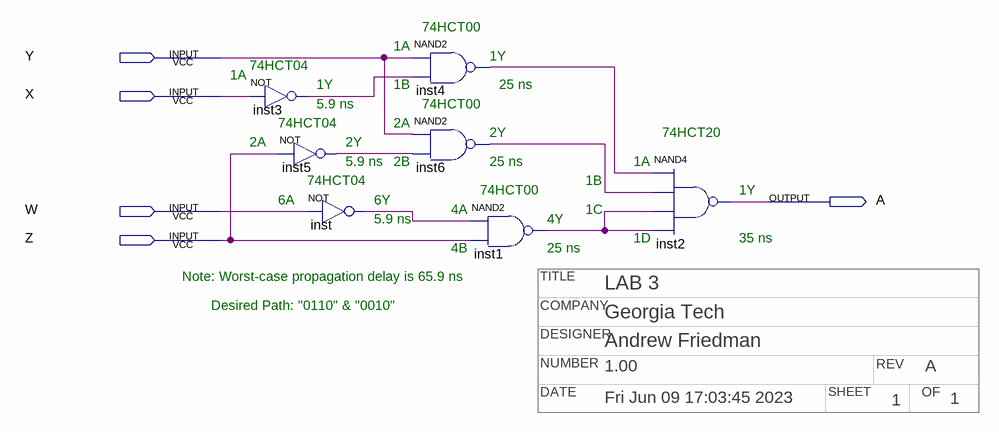
[diagram p0: schematic sheet]
// Quartus schematic Lab2.bdf as structural Verilog: 7 symbols, 5 pins
// Title block: COMPANY: Georgia Tech; DATE: Fri Jun 09 17:03:45 2023; DESIGNER: Andrew Friedman; NUMBER: 1.00; OF: 1; REV: A; SHEET: 1; TITLE: LAB 3
module Lab2 (
  input  Y,
  input  X,
  input  W,
  input  Z,
  output A
);

  wire inst1_out, inst3_out, inst4_out, inst5_out, inst6_out, inst_out;

  not inst3 (inst3_out, X);
  not inst5 (inst5_out, Z);
  not inst (inst_out, W);
  nand inst4 (inst4_out, Y, inst3_out);
  nand inst6 (inst6_out, Y, inst5_out);
  nand inst1 (inst1_out, inst_out, Z);
  nand inst2 (A, inst4_out, inst6_out, inst1_out, inst1_out);

  // Notes on the sheet:
  //   74HCT00
  //   1A
  //   1Y
  //   74HCT04
  //   1A
  //   1Y
  //   1B
  //   25 ns
  //   5.9 ns
  //   74HCT00
  //   74HCT04
  //   2A
  //   2Y
  //   74HCT20
  //   2A
  //   2Y
  //   5.9 ns
  //   2B
  //   25 ns
  //   1A
  //   74HCT04
  //   1B
  //   74HCT00
  //   1Y
  //   6A
  //   6Y
  //   4A
  //   1C
  //   5.9 ns
  //   4Y
  //   1D
  //   35 ns
  //   4B
  //   25 ns
  //   Note: Worst-case propagation delay is 65.9 ns
  //   Desired Path: "0110" & "0010"
endmodule
